# Altium schematic sheet Button.SchDoc
size A; SheetNumber: 5; SheetTotal: 9
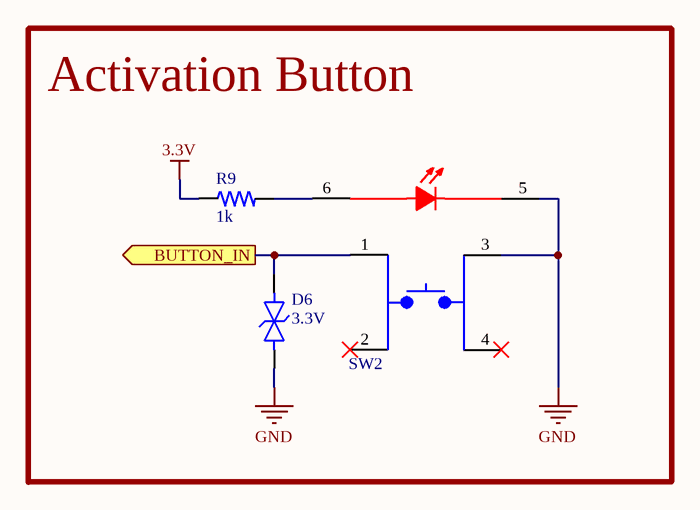
[diagram p0: Button.SchDoc]

## Parts
D6  VRS: 3.3V  [0402-TVS]  (hidden comment: DESD3V3E1BL-7B)
R9  value 1k  [0402R]  (hidden comment: RES)
SW2  SPDT PUSH BUTTON SWITCH  [TL1265RQSCLR]  (value not drawn)

## Blocks framed on the sheet
Activation Button: D6 R9 SW2

## Ports
BUTTON_IN (out, see Christmas-2024_TSO-PCB_MASTER[2B], MCU[4B])

## Nets
3.3V: R9.1
GND: D6.2 SW2.3 SW2.5
BUTTON_IN: D6.1 SW2.1 ; port BUTTON_IN
NetR9_2: R9.2 SW2.6

Not connected (* = marked no-connect by the designer): SW2 2* 4*

## Library data of the parts
D6 = TVS Diode 3.3V Bi: TVS DIODE 3.3VWM 7VC DFN1006-2; MFR: Diodes Incorporated; Type: SMD; VBR: 3.8V; VC: 7V; MFR PN: DESD3V3E1BL-7B
R9 = RES: Resistor; MFR PN: RC0402JR-071KL; MFR: YAGEO; Type: SMD
SW2 = SPDT PUSH BUTTON SWITCH: SWITCH TACTILE SPST-NO 0.05A 12V, Red Illumination; MFR: E-Switch; MFR PN: TL1265RQSCLR; Type: SMD